# EAGLE board module_decoding_b (EAGLE 6.5.0)
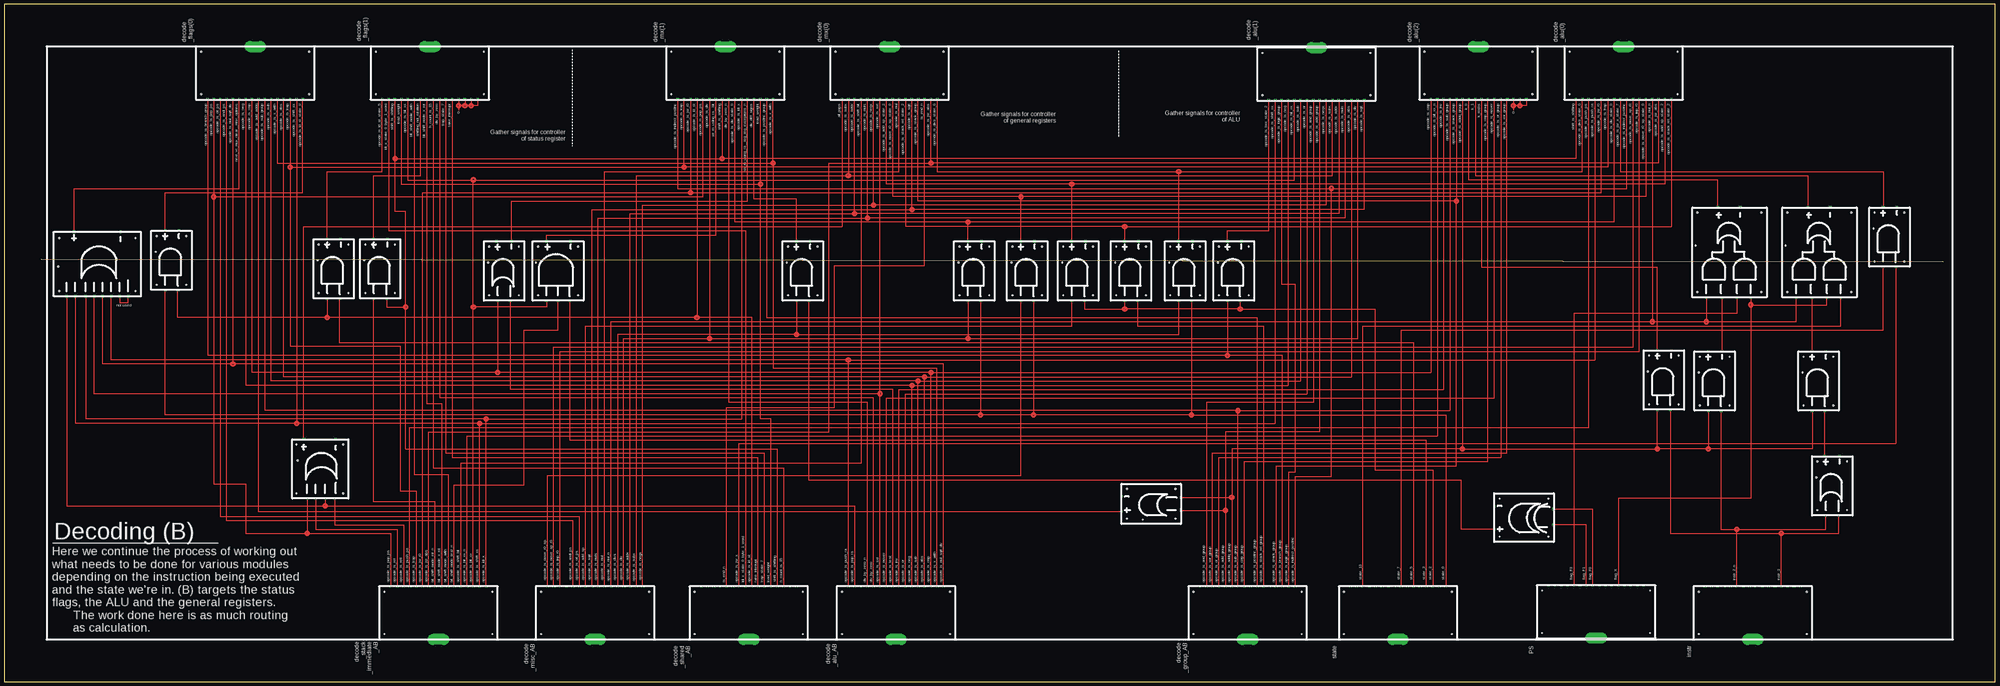
[diagram p11: board, top side]

Size 1193.8 x 406.4 mm. Coordinates in mm from the lower left corner, seen from the top.
Outline: 0,0 1193.8,0 1193.8,406.4 0,406.4 0,0
Copper layers (1*16): Top 0.035mm / dielectric 1.5mm / Bottom 0.035mm
Design rules "default": minimum track width 10mil, minimum drill 24mil, track to track 8mil, track to pad 8mil, pad to pad 8mil, via to via 8mil, smd to smd 8mil, copper to edge 40mil, drill to drill 8mil, minimum pad ring 10mil, minimum via ring 8mil, stop-mask expansion 4mil, vias tented up to drill 0mil, thermal gap 10mil
tKeepout: area 587.8,16.3 to 606,34.5; area 587.8,371.9 to 606,390.1; area 1159.3,371.9 to 1177.5,390.1; area 16.3,371.9 to 34.5,390.1; area 1159.3,16.3 to 1177.5,34.5; area 16.3,16.3 to 34.5,34.5
Milling: 1 lines

## Footprints (pad centres in the part's own frame; a part is rotated, then mirrored left to right if it is on the bottom)
2AND = drill 0.8 square: OUT_M 19.05,-4.445; OUT_P 19.05,3.81; P$1 -16.51,-3.81; P$2 -16.51,3.81 | hole 0.6: -13.335,8.89; 15.875,-8.89; -13.335,-8.89; 15.875,8.89; 6.35,9.525
BUS_SPLIT_DISPLAY = drill 0.8 pad 6.452 long: INPUT 0,15.24 | drill 0.8 square: P$1 -28.575,-16.51; P$2 -24.765,-16.51; P$3 -20.955,-16.51; P$4 -17.145,-16.51; P$5 -13.335,-16.51; P$6 -9.525,-16.51; P$7 -5.715,-16.51; P$8 -1.905,-16.51; P$9 1.905,-16.51; P$10 5.715,-16.51; P$11 9.525,-16.51; P$12 13.335,-16.51; P$13 17.145,-16.51; P$14 20.955,-16.51; P$15 24.765,-16.51; P$16 28.575,-16.51 | hole 0.6: -32.385,-13.335; -32.385,12.065; 32.385,12.065; 32.385,-13.335
2OR = drill 0.8 square: OUT_M 17.78,-4.445; OUT_P 17.78,4.445; P$1 -17.78,-3.81; P$2 -17.78,3.81 | hole 0.6: -14.605,8.89; 14.605,-8.89; 14.605,8.89; -14.605,-8.89; 5.08,9.525
2X2AND_OR = drill 0.8 square: OUT_M 27.94,-6.985; OUT_P 27.94,6.35; P$1 -26.035,-13.335; P$2 -26.035,-5.08; P$3 -26.035,3.81; P$4 -26.035,13.335 | hole 0.6: -22.86,18.733; 24.765,18.733; -22.86,-19.685; 24.765,-19.685; 5.08,19.685
8OR = drill 0.8 square: 1 -21.59,-17.78; 2 -21.59,-12.7; 3 -21.59,-7.62; 4 -21.59,-2.54; 5 -21.59,2.54; 6 -21.59,7.62; 7 -21.59,13.97; 8 -21.59,19.05; OUT_M 17.145,-13.335; OUT_P 17.145,14.605 | hole 0.6: -18.415,-22.225; 13.335,-22.225; 13.335,23.495; -18.415,23.495; -3.81,24.13
4OR = drill 0.8 square: 1 -16.51,-8.255; 2 -16.51,-2.54; 3 -16.51,3.175; 4 -16.51,8.255; OUT_M 19.05,-8.89; OUT_P 19.05,10.16 | hole 0.6: -13.335,-13.335; 15.875,-13.335; 15.875,14.605; -13.335,14.605; 6.35,13.97
3AND = drill 0.8 square: OUT_M 16.51,-7.62; OUT_P 16.51,6.985; P$1 -19.05,-6.985; P$2 -19.05,0; P$3 -19.05,6.985 | hole 0.6: -15.875,-12.065; 13.335,-12.065; 13.335,12.065; -15.875,12.065; 3.81,13.335
XOR = drill 0.8 square: OUT_N 17.78,-6.985; OUT_P 17.78,6.35; P$1 -17.78,-5.715; P$2 -17.78,3.81 | hole 0.6: -14.605,10.795; 14.605,-12.065; 14.605,10.795; -14.605,-12.065

## Placement (x,y rotation side)
CMP1  2AND  [2AND]  995.04,179.71 90 top
CMP2  BUS_SPLIT_DISPLAY  [BUS_SPLIT_DISPLAY]  745.49,40.64 180 top
CMP3  BUS_SPLIT_DISPLAY  [BUS_SPLIT_DISPLAY]  260.35,40.64 180 top
CMP4  2OR  [2OR]  1096.01,117.47 90 top
CMP5  2AND  [2AND]  1087.76,179.07 90 top
CMP6  2AND  [2AND]  1025.53,179.07 90 top
CMP7  2X2AND_OR  [2X2AND_OR]  1087.76,256.54 90 top
CMP8  2X2AND_OR  [2X2AND_OR]  1033.78,256.54 90 top
CMP9  2AND  [2AND]  100.33,251.46 90 top
CMP10  2AND  [2AND]  197.49,246.38 90 top
CMP11  2AND  [2AND]  225.43,246.38 90 top
CMP12  2OR  [2OR]  687.71,106.68 180 top
CMP13  BUS_SPLIT_DISPLAY  [BUS_SPLIT_DISPLAY]  835.66,40.64 180 top
CMP14  8OR  [8OR]  56.52,252.73 90 top
CMP15  BUS_SPLIT_DISPLAY  [BUS_SPLIT_DISPLAY]  1048.38,40.64 180 top
CMP16  2AND  [2AND]  613.41,245.11 90 top
CMP17  BUS_SPLIT_DISPLAY  [BUS_SPLIT_DISPLAY]  954.4,41.27 180 top
CMP18  2AND  [2AND]  643.89,245.11 90 top
CMP19  2AND  [2AND]  737.24,245.11 90 top
CMP20  2AND  [2AND]  675.64,245.11 90 top
CMP21  2AND  [2AND]  1130.3,265.43 90 top
CMP35  BUS_SPLIT_DISPLAY  [BUS_SPLIT_DISPLAY]  354.33,40.64 180 top
CMP37  4OR  [4OR]  189.87,126.36 90 top
CMP41  2AND  [2AND]  581.66,245.11 90 top
CMP42  2AND  [2AND]  708.02,245.11 90 top
CMP47  BUS_SPLIT_DISPLAY  [BUS_SPLIT_DISPLAY]  534.67,40.64 180 top
CMP56  BUS_CONSTRUCT_DISPLAY  [BUS_SPLIT_DISPLAY]  150.5,365.76 0 top
CMP57  BUS_SPLIT_DISPLAY  [BUS_SPLIT_DISPLAY]  446.4,40.64 180 top
CMP68  2AND  [2AND]  478.79,245.11 90 top
CMP79  BUS_CONSTRUCT_DISPLAY  [BUS_SPLIT_DISPLAY]  255.27,365.76 0 top
CMP80  3AND  [3AND]  332.11,247.65 90 top
CMP87  BUS_CONSTRUCT_DISPLAY  [BUS_SPLIT_DISPLAY]  786.76,365.12 0 top
CMP91  BUS_CONSTRUCT_DISPLAY  [BUS_SPLIT_DISPLAY]  970.91,365.76 0 top
CMP93  BUS_CONSTRUCT_DISPLAY  [BUS_SPLIT_DISPLAY]  883.92,365.76 0 top
CMP95  BUS_CONSTRUCT_DISPLAY  [BUS_SPLIT_DISPLAY]  530.86,365.76 0 top
CMP99  BUS_CONSTRUCT_DISPLAY  [BUS_SPLIT_DISPLAY]  432.44,365.76 0 top
CMP100  XOR  [XOR]  911.23,97.79 180 top
CMP103  2OR  [2OR]  299.72,246.38 90 top

## Tracks (layer width: path | path; a pad name or v marks a point on that pad's centre or on a via)
ALL_POPS
  Top 0.61: CMP37.OUT_P 179.71,273.05 502.29,273.05 CMP95.P$1
BIT_SHIFT_MODE__CHANGE__ARITH
  Top 0.61: CMP79.P$6 245.75,124.46 266.06,124.46 CMP3.P$7
BIT_SHIFT_MODE__ROT_N
  Top 0.61: CMP3.P$9 258.44,107.95 221.62,107.95 CMP11.P$2
BIT_SHIFT_MODE__SET__X_ROT
  Top 0.61: CMP79.P$8 253.37,167 262.25,167 CMP3.P$8
BIT_SHIFT_MODE__TEST_N
  Top 0.61: CMP3.P$6 269.88,118.11 311.79,118.11 311.79,210.82 332.11,210.82 CMP80.P$2
DIFF_SIGN
  Top 0.61: CMP100.OUT_P 873.76,91.44 873.76,120.65 482.6,120.65 CMP68.P$1
DIV_BY_ZERO
  Top 0.61: CMP47.P$12 521.34,170.18 260.99,170.18 CMP79.P$10
DIV_BY_ZERO_N
  Top 0.61: CMP47.P$13 517.52,167.64 434.34,167.64 CMP99.P$9
DIV_DIFF_SIGN
  Top 0.61: CMP68.OUT_P 474.98,289.56 449.58,289.56 CMP99.P$13
FLAG_F0
  Top 0.61: CMP17.P$9 952.5,103.5 CMP100.P$1
FLAG_F1
  Top 0.61: CMP17.P$10 948.69,93.98 CMP100.P$2
FLAG_F3
  Top 0.61: CMP8.P$2 1038.86,220.98 941.07,220.98 CMP17.P$12
FLAG_X
  Top 0.61: CMP8.P$1 1047.12,226.06 | 1047.12,226.06 1092.84,226.06 CMP7.P$2 | 1047.12,226.06 1047.12,109.86 967.74,109.86 CMP17.P$5
H_COUNT_IS_15
  Top 0.61: CMP79.P$9 257.18,128.27 467.36,128.27 CMP57.P$3
INSTR_2_N
  Top 0.61: CMP15.P$11 1038.86,91.44 | 1038.86,91.44 1092.2,91.44 CMP4.P$2 | CMP6.P$1 1029.34,91.44 1038.86,91.44
INSTR_3
  Top 0.61: CMP15.P$4 1065.53,88.9 | 1065.53,88.9 1099.82,88.9 CMP4.P$1 | CMP1.P$1 998.86,88.9 1065.53,88.9
IS_END_N
  Top 0.61: CMP57.P$12 433.07,164.47 497.84,164.47 497.84,249.56 551.82,249.56 CMP95.P$14
K_BIT_0
  Top 0.61: CMP6.OUT_M CMP8.P$3
K_BIT_1
  Top 0.61: CMP5.OUT_P CMP7.P$3
K_MSBS
  Top 0.61: CMP1.OUT_P 991.24,248.28 885.83,248.28 CMP93.P$9
K_NOT_P1
  Top 0.61: CMP4.OUT_P CMP5.P$1
K_VALUE_0
  Top 0.61: CMP8.OUT_P 1027.43,300.99 878.21,300.99 CMP93.P$7
K_VALUE_1
  Top 0.61: CMP93.P$8 882.01,303.53 1081.4,303.53 CMP7.OUT_P
LDI_X_STATE_0_BYTE_1_WORD
  Top 0.61: CMP79.P$2 230.5,270.51 444.5,270.51 CMP57.P$9
LOAD_WEIGHT
  Top 0.61: CMP79.P$4 238.12,298.45 453.39,298.45 | 453.39,298.45 CMP99.P$14 | CMP57.P$5 459.74,157.48 453.39,157.48 453.39,298.45
N$1
  Top 0.61: CMP14.2 69.22,227.33 74.3,227.33 CMP14.1
N$2
  Top 0.61: CMP79.P$13 272.42,345.44 | 272.42,345.44 272.42,342.9 | CMP79.P$16 283.85,345.44 280.04,345.44 | 280.04,345.44 276.23,345.44 | 276.23,345.44 272.42,345.44 | CMP79.P$15 280.04,345.44 | CMP79.P$14 276.23,345.44
N$9
  Top 0.61: CMP93.P$14 904.88,345.44 | 904.88,345.44 904.88,342.9 | CMP93.P$16 912.5,345.44 908.68,345.44 | 908.68,345.44 904.88,345.44 | CMP93.P$15 908.68,345.44
NEXT_VC_MUX_CLEAR__MISC_OPTIONS
  Top 0.61: CMP14.OUT_P 41.91,295.91 140.97,295.91 CMP56.P$6
OPCODE_IS_ABS
  Top 0.61: CMP47.P$4 551.82,182.88 | 551.82,182.88 807.72,182.88 CMP87.P$14 | 551.82,182.88 167.64,182.88 CMP56.P$13
OPCODE_IS_ADD_ADDQ
  Top 0.61: CMP56.P$9 152.4,102.23 CMP12.OUT_P
OPCODE_IS_ADD_GROUP
  Top 0.61: CMP87.P$9 788.67,149.86 732.15,149.86 732.15,102.87 | 732.15,102.87 CMP2.P$12 | CMP12.P$2 732.15,102.87
OPCODE_IS_ADD_SP
  Top 0.61: CMP35.P$10 348.62,213.36 640.08,213.36 CMP18.P$2
OPCODE_IS_ADD_SP_STATE_2
  Top 0.61: CMP91.P$15 995.68,298.45 640.08,298.45 | 640.08,298.45 528.96,298.45 CMP95.P$8 | CMP18.OUT_P 640.08,298.45
OPCODE_IS_ADDQ_GROUP
  Top 0.61: CMP93.P$6 874.39,139.7 | 874.39,139.7 735.97,139.7 735.97,110.49 | 735.97,110.49 CMP2.P$11 | CMP12.P$1 735.97,110.49 | 874.39,139.7 991.24,139.7 | CMP5.P$2 1083.94,139.7 1021.72,139.7 | 1021.72,139.7 991.24,139.7 | 991.24,139.7 CMP1.P$2 | CMP6.P$2 1021.72,139.7
OPCODE_IS_ADDX
  Top 0.61: CMP87.P$12 800.1,280.67 509.9,280.67 | 509.9,280.67 CMP95.P$3 | CMP35.P$3 375.29,280.67 509.9,280.67
OPCODE_IS_AND_GROUP
  Top 0.61: CMP87.P$8 784.86,167.64 720.73,167.64 CMP2.P$15
OPCODE_IS_ANDI_PS
  Top 0.61: CMP35.P$12 341,96.52 133.35,96.52 CMP56.P$4
OPCODE_IS_BIT_XX
  Top 0.61: CMP79.P$5 241.94,300.99 281.31,300.99 | 281.31,300.99 773.43,300.99 CMP87.P$5 | CMP3.P$3 281.31,224.79 | 281.31,224.79 281.31,300.99 | CMP80.P$3 325.12,224.79 281.31,224.79
OPCODE_IS_BIT_XX_N
  Top 0.61: CMP3.P$4 277.5,147.32 859.15,147.32 CMP93.P$2
OPCODE_IS_BRANCH_GROUP
  Top 0.61: CMP2.P$3 766.45,195.58 733.42,195.58 | 733.42,195.58 121.92,195.58 CMP56.P$1 | CMP19.P$2 733.42,195.58
OPCODE_IS_BXX_STATE_2
  Top 0.61: CMP19.OUT_P 733.42,270.51 758.19,270.51 CMP87.P$1
OPCODE_IS_CMP
  Top 0.61: CMP47.P$3 555.62,185.42 | 555.62,185.42 855.35,185.42 CMP93.P$1 | 555.62,185.42 295.91,185.42 | 295.91,185.42 148.59,185.42 CMP56.P$8 | CMP103.P$2 295.91,185.42
OPCODE_IS_CMP_GROUP
  Top 0.61: CMP2.P$9 743.59,132.08 889.63,132.08 CMP93.P$10
OPCODE_IS_DIV
  Top 0.61: CMP35.P$4 371.48,205.74 422.91,205.74 | 422.91,205.74 577.85,205.74 | 577.85,205.74 811.53,205.74 CMP87.P$15 | CMP41.P$2 577.85,205.74 | CMP99.P$6 422.91,205.74
OPCODE_IS_DIV_STATE_0
  Top 0.61: CMP91.P$7 965.2,275.59 577.85,275.59 | 577.85,275.59 438.15,275.59 CMP99.P$10 | CMP41.OUT_P 577.85,275.59
OPCODE_IS_DIVS
  Top 0.61: CMP68.P$2 474.98,208.28 | 474.98,208.28 704.22,208.28 CMP42.P$2 | 474.98,208.28 367.67,208.28 CMP35.P$5
OPCODE_IS_DIVS_STATE_0
  Top 0.61: CMP95.P$16 559.43,306.07 704.22,306.07 | 704.22,306.07 946.15,306.07 CMP91.P$2 | CMP42.OUT_P 704.22,306.07
OPCODE_IS_INDIRECT_POSTINC
  Top 0.61: CMP99.P$1 403.86,295.91 795.65,295.91 | 795.65,295.91 972.82,295.91 CMP91.P$9 | CMP2.P$1 774.07,123.19 795.65,123.19 795.65,295.91
OPCODE_IS_INV
  Top 0.61: CMP47.P$8 536.58,175.26 862.97,175.26 CMP93.P$3
OPCODE_IS_JMP_R0
  Top 0.61: CMP35.P$14 333.38,198.12 980.44,198.12 CMP91.P$11
OPCODE_IS_JSR_ABS
  Top 0.61: CMP91.P$14 991.87,311.15 555.62,311.15 | 555.62,311.15 CMP95.P$15 | CMP3.P$10 254.63,149.86 494.67,149.86 494.67,311.15 555.62,311.15
OPCODE_IS_JSR_R0
  Top 0.61: CMP99.P$3 411.48,293.37 | 411.48,293.37 957.58,293.37 CMP91.P$5 | CMP3.P$11 250.82,293.37 411.48,293.37
OPCODE_IS_JSR_X
  Top 0.61: CMP21.P$1 1134.11,142.88 440.69,142.88 CMP57.P$10
OPCODE_IS_JSR_X_STATE_7
  Top 0.61: CMP91.P$8 969.01,306.07 1126.49,306.07 CMP21.OUT_P
OPCODE_IS_LD_ST
  Top 0.61: CMP99.P$4 415.29,218.44 | 415.29,218.44 193.68,218.44 | 193.68,218.44 104.14,218.44 CMP9.P$1 | CMP10.P$2 193.68,218.44 | CMP57.P$8 448.31,218.44 415.29,218.44
OPCODE_IS_LD_ST_STATE_0
  Top 0.61: CMP9.OUT_P 96.52,293.37 179.07,293.37 CMP56.P$16
OPCODE_IS_LD_ST_STATE_5
  Top 0.61: CMP10.OUT_P 193.68,306.07 226.69,306.07 CMP79.P$1
OPCODE_IS_LDI_X
  Top 0.61: CMP3.P$1 288.93,157.48 | 288.93,157.48 441.96,157.48 CMP99.P$11 | 288.93,157.48 48.9,157.48 CMP14.6
OPCODE_IS_LOGIC_GROUP
  Top 0.61: CMP87.P$3 765.81,238.12 774.07,238.12 774.07,125.73 770.25,125.73 CMP2.P$2
OPCODE_IS_MOVE_R0_SP
  Top 0.61: CMP35.P$16 325.75,123.83 609.6,123.83 CMP16.P$2
OPCODE_IS_MOVE_R0_SP_STATE_0
  Top 0.61: CMP91.P$12 984.25,290.83 609.6,290.83 | 609.6,290.83 532.76,290.83 CMP95.P$9 | CMP16.OUT_P 609.6,290.83
OPCODE_IS_MOVE_SP_R0
  Top 0.61: CMP35.P$15 329.56,200.66 976.63,200.66 CMP91.P$10
OPCODE_IS_MOVER
  Top 0.61: CMP47.P$10 528.96,170.18 893.45,170.18 CMP93.P$11
OPCODE_IS_MUL
  Top 0.61: CMP35.P$7 360.05,306.07 536.58,306.07 CMP95.P$10
OPCODE_IS_MUL_N
  Top 0.61: CMP35.P$6 363.86,215.9 988.06,215.9 | 988.06,215.9 1020.45,215.9 | 1020.45,215.9 1074.42,215.9 CMP7.P$4 | CMP8.P$4 1020.45,215.9 | CMP91.P$13 988.06,215.9
OPCODE_IS_MUL_SQRT_DIV
  Top 0.61: CMP47.P$1 563.25,190.5 137.16,190.5 | 137.16,190.5 59.05,190.5 CMP14.4 | CMP56.P$5 137.16,190.5
OPCODE_IS_MULS
  Top 0.61: CMP87.P$13 803.91,278.13 517.52,278.13 | 517.52,278.13 CMP95.P$5 | CMP35.P$8 356.24,278.13 517.52,278.13
OPCODE_IS_NEG
  Top 0.61: CMP47.P$6 544.2,177.8 | 544.2,177.8 769.62,177.8 CMP87.P$4 | 544.2,177.8 144.78,177.8 CMP56.P$7
OPCODE_IS_NEGX
  Top 0.61: CMP87.P$10 792.48,285.75 521.34,285.75 | 521.34,285.75 CMP95.P$6 | CMP35.P$1 382.9,285.75 521.34,285.75
OPCODE_IS_OR
  Top 0.61: CMP47.P$7 540.38,172.72 781.05,172.72 CMP87.P$7
OPCODE_IS_OR_GROUP
  Top 0.61: CMP2.P$13 728.35,134.62 897.25,134.62 CMP93.P$12
OPCODE_IS_ORI_PS
  Top 0.61: CMP56.P$3 129.54,99.06 344.81,99.06 CMP35.P$11
OPCODE_IS_POP_PS
  Top 0.61: CMP56.P$2 125.73,290.83 | 125.73,290.83 419.1,290.83 CMP99.P$5 | 125.73,290.83 125.73,118.75 144.78,118.75 144.78,88.9 181.61,88.9 | 181.61,88.9 231.78,88.9 CMP3.P$16 | CMP37.4 181.61,88.9
OPCODE_IS_POP_RA
  Top 0.61: CMP37.2 192.41,105.41 | 192.41,105.41 509.9,105.41 CMP47.P$15 | CMP14.8 37.47,105.41 192.41,105.41
OPCODE_IS_POSTINC_GROUP
  Top 0.61: CMP99.P$15 457.2,218.44 751.21,218.44 CMP2.P$7
OPCODE_IS_PUSH_PS
  Top 0.61: CMP3.P$13 243.21,152.4 949.96,152.4 CMP91.P$3
OPCODE_IS_PUSH_RA
  Top 0.61: CMP47.P$16 506.1,193.04 | 506.1,193.04 953.77,193.04 CMP91.P$4 | 506.1,193.04 64.14,193.04 CMP14.3
OPCODE_IS_RET
  Top 0.61: CMP37.3 186.69,91.44 235.59,91.44 CMP3.P$15
OPCODE_IS_RETI
  Top 0.61: CMP37.1 198.12,93.98 239.4,93.98 CMP3.P$14
OPCODE_IS_SHIFT_BIT
  Top 0.61: CMP95.P$4 513.72,130.81 273.69,130.81 CMP3.P$5
OPCODE_IS_SHIFT_XX
  Top 0.61: CMP3.P$2 285.12,154.94 | 285.12,154.94 762,154.94 CMP87.P$2 | 285.12,154.94 175.26,154.94 | CMP56.P$15 175.26,154.94 | 175.26,154.94 42.55,154.94 CMP14.7
OPCODE_IS_SQRT
  Top 0.61: CMP87.P$16 815.34,283.21 544.2,283.21 | 544.2,283.21 CMP95.P$12 | CMP35.P$9 352.43,283.21 544.2,283.21
OPCODE_IS_STACK_GROUP
  Top 0.61: CMP93.P$5 870.59,288.29 | 870.59,288.29 548,288.29 CMP95.P$13 | CMP2.P$4 762.63,129.54 870.59,129.54 870.59,288.29
OPCODE_IS_STACK_REL_GROUP
  Top 0.61: CMP20.P$1 679.45,213.36 755.01,213.36 CMP2.P$6
OPCODE_IS_STACK_REL_STATE_2
  Top 0.61: CMP20.OUT_P 671.83,273.05 | 671.83,273.05 540.38,273.05 CMP95.P$11 | 671.83,273.05 999.49,273.05 CMP91.P$16
OPCODE_IS_SUB
  Top 0.61: CMP47.P$5 548,180.34 | 548,180.34 777.24,180.34 CMP87.P$6 | 548,180.34 160.02,180.34 CMP56.P$11
OPCODE_IS_SUB_GROUP
  Top 0.61: CMP2.P$10 739.77,162.56 | 739.77,162.56 156.21,162.56 CMP56.P$10 | 739.77,162.56 866.77,162.56 CMP93.P$4
OPCODE_IS_SUBX
  Top 0.61: CMP95.P$2 506.1,303.53 | 506.1,303.53 796.29,303.53 CMP87.P$11 | CMP35.P$2 379.1,303.53 506.1,303.53
OPCODE_IS_SXT
  Top 0.61: CMP47.P$11 525.14,172.72 | 525.14,172.72 53.98,172.72 CMP14.5 | 525.14,172.72 CMP95.P$7
OPCODE_IS_TEST
  Top 0.61: CMP47.P$9 532.76,175.26 303.53,175.26 CMP103.P$1
OPCODE_IS_TRAP
  Top 0.61: CMP56.P$14 171.45,308.61 | 171.45,308.61 407.67,308.61 | 407.67,308.61 CMP99.P$2 | CMP91.P$6 961.39,308.61 407.67,308.61 | 171.45,308.61 171.45,201.29 237.49,201.29 237.49,114.3 247.01,114.3 CMP3.P$12
OPCODE_IS_X_ARITH
  Top 0.61: CMP56.P$12 163.83,311.15 461.01,311.15 | 461.01,311.15 CMP99.P$16 | CMP47.P$2 559.43,187.96 461.01,187.96 461.01,311.15
OPCODE_IS_XOR_GROUP
  Top 0.61: CMP2.P$14 724.53,137.16 901.07,137.16 CMP93.P$13
SHIFT_IS_SHIFTING
  Top 0.61: CMP91.P$1 942.34,313.69 430.53,313.69 | 234.31,313.69 CMP79.P$3 | CMP99.P$8 430.53,313.69 | CMP57.P$4 463.55,139.7 240.66,139.7 240.66,224.79 | 234.31,313.69 430.53,313.69 | 240.66,224.79 240.66,281.94 234.31,281.94 234.31,313.69 | CMP11.P$1 229.24,224.79 240.66,224.79
SHIFTING_NOT_ROTATION
  Top 0.61: CMP11.OUT_P 221.62,303.53 249.56,303.53 CMP79.P$7
STATE_0
  Top 0.61: CMP41.P$1 585.47,160.02 | CMP16.P$1 617.22,160.02 | 617.22,160.02 585.47,160.02 | CMP42.P$1 711.84,160.02 | 711.84,160.02 617.22,160.02 | 711.84,160.02 864.24,160.02 CMP13.P$1 | 585.47,160.02 96.52,160.02 CMP9.P$2
STATE_2
  Top 0.61: CMP18.P$1 647.7,223.52 671.83,223.52 | 671.83,223.52 CMP20.P$2 | CMP19.P$1 741.04,223.52 | 741.04,223.52 671.83,223.52 | 741.04,223.52 821.69,223.52 821.69,127 856.62,127 CMP13.P$3
STATE_3
  Top 0.61: CMP13.P$4 852.8,144.78 339.09,144.78 CMP80.P$1
STATE_5
  Top 0.61: CMP13.P$6 845.18,203.2 201.29,203.2 CMP10.P$1
STATE_7
  Top 0.61: CMP13.P$8 837.57,210.82 1126.49,210.82 CMP21.P$2
STATE_13
  Top 0.61: CMP13.P$14 814.71,213.36 1101.09,213.36 CMP7.P$1
TAKE_INTERRUPT
  Top 0.61: CMP79.P$12 268.61,134.62 452.12,134.62 CMP57.P$7
TRAP_STATE_7
  Top 0.61: CMP79.P$11 264.8,137.16 455.93,137.16 CMP57.P$6
WR_RN_USING_RA__BIT
  Top 0.61: CMP80.OUT_P 325.12,267.97 426.72,267.97 CMP99.P$7
WR_RN_USING_RA__REG_REG_EXCEPTIONS_N
  Top 0.61: CMP103.OUT_M 304.17,288.29 445.77,288.29 CMP99.P$12
(copper drawn outside any net)
  shapes: Top circle x64

## Text on the board
tPlace: decode / _alu(1) | decode / _flags(0) | decode / _flags(1) | decode / _rnx(1) | decode / _rnx(0) | decode / _alu(2) | decode / _alu(0) | opcode_is_branch_group | opcode_is_pop_ps | opcode_is_ori_ps | opcode_is_andi_ps | opcode_is_mul_sqrt_div | next_vc_mux_clear__misc_options | opcode_is_neg | opcode_is_cmp | opcode_is_add_addq | opcode_is_sub_group | opcode_is_sub | opcode_is_x_arith | opcode_is_abs | opcode_is_trap | opcode_is_shift_xx | opcode_is_ld_st_state_0 | opcode_is_ld_st_state_5 | ldi_x_state_0_byte_1_word | shift_is_shifting | load_weight | opcode_is_bit_xx | bit_shift_mode_arith | shifting_not_rotation | bit_shift_mode_x_rot | h_count_is_15 | div_by_zero | trap_state_7 | take_interrupt | opcode_is_indirect_postinc | opcode_is_trap | opcode_is_jsr_r0 | opcode_is_ld_st | opcode_is_pop_ps | opcode_is_div | wr_rn_using_ra__bit | shift_is_shifting | div_by_zero_n | opcode_is_div_state_0 | opcode_is_ldi_x | wr_rn_using_ra__reg_reg_exceptions_n | div_diff_signs | load_weight | opcode_is_postinc_group | opcode_is_x_arith | all_pops | opcode_is_subx | opcode_is_addx | opcode_is_shift_bit | opcode_is_muls | opcode_is_negx | opcode_is_sxt | opcode_is_add_sp_state_2 | opcode_is_move_r0_sp_state_0 | opcode_is_mul | opcode_is_stack_rel_state_2 | opcode_is_sqrt | opcode_is_stack_group | is_end_n | opcode_is_jsr_abs | opcode_is_divs_state_0 | opcode_is_cmp | opcode_is_bit_xx_n | opcode_is_inv | opcode_is_sub_group | opcode_is_stack_group | opcode_is_addq_group | k_0 | k_1 | k_msbs | opcode_is_cmp_group | opcode_is_mover | opcode_is_or_group | opcode_is_xor_group | shift_is_shifting | opcode_is_divs_state_0 | opcode_is_push_ps | opcode_is_push_ra | opcode_is_jsr_r0 | opcode_is_trap | opcode_is_div_state_0 | opcode_is_jsr_x_state_7 | opcode_is_indirect_postinc | opcode_is_move_sp_r0 | opcode_is_jmp_r0 | opcode_is_move_r0_sp_state_0 | opcode_is_mul_n | opcode_is_jsr_abs | opcode_is_add_sp_state_2 | opcode_is_stack_rel_state_2 | opcode_is_bxx_state_2 | opcode_is_shift_xx | opcode_is_logic_group | opcode_is_neg | opcode_is_bit_xx | opcode_is_sub | opcode_is_or | opcode_is_and_group | opcode_is_add_group | opcode_is_negx | opcode_is_subx | opcode_is_addx | opcode_is_muls | opcode_is_abs | opcode_is_div | opcode_is_sqrt | Gather signals for controller / of general registers | Gather signals for controller / of ALU | 0 | 0 | Gather signals for controller / of status register | not used | Decoding (B) | opcode_is_move_r0_sp | opcode_is_move_sp_r0 | opcode_is_jmp_r0 | opcode_is_andi_ps | opcode_is_ori_ps | opcode_is_add_sp | opcode_is_sqrt | opcode_is_muls | opcode_is_mul | opcode_is_divs | opcode_is_div | opcode_is_addx | opcode_is_negx | state_13 | state_7 | state_5 | state_3 | state_2 | state_0 | flag_F3 | flag_F1 | flag_F0 | flag_X | instr_2_n | instr_3 | opcode_is_pop_ps | opcode_is_ret | opcode_is_reti | opcode_is_push_ps | opcode_is_trap | opcode_is_jsr_r0 | opcode_is_jsr_abs | bit_shift_mode_rot_n | bit_shift_mode_x_rot | bit_shift_mode_arith | bit_shift_mode_test_n | opcode_is_shift_bit | opcode_is_bit_xx_n | opcode_is_bit_xx | opcode_is_shift_xx | opcode_is_ldi_x | opcode_is_mul_n | opcode_is_subx | is_end_n | opcode_is_jsr_x | ldi_x_state_0_byte_1_word | opcode_is_ld_st | take_interrupt | trap_state_7 | load_weight | shift_is_shifting | h_count_is_15 | opcode_is_push_ra | opcode_is_pop_ra | div_by_zero_n | div_by_zero | opcode_is_sxt | opcode_is_mover | opcode_is_test | opcode_is_inv | opcode_is_or | opcode_is_neg | opcode_is_sub | opcode_is_abs | opcode_is_cmp | opcode_is_x_arith | opcode_is_mul_sqrt_div | opcode_is_and_group | opcode_is_xor_group | opcode_is_or_group | opcode_is_add_group | opcode_is_addq_group | opcode_is_sub_group | opcode_is_cmp_group | opcode_is_postinc_group | opcode_is_stack_rel_group | opcode_is_stack_group | opcode_is_branch_group | opcode_is_logic_group | opcode_is_indirect_postinc | Here we continue the process of working out / what needs to be done for various modules / depending on the instruction being executed / and the state we're in. (B) targets the status / flags, the ALU and the general registers. / The work done here is as much routing / as calculation. | decode / _stack / _immediate / _AB | decode / _misc_AB | decode / _alu_AB | decode / _group_AB | decode / _shared / _AB | state | PS | instr